# EAGLE design ESP12Breakout (EAGLE 7.7.0)
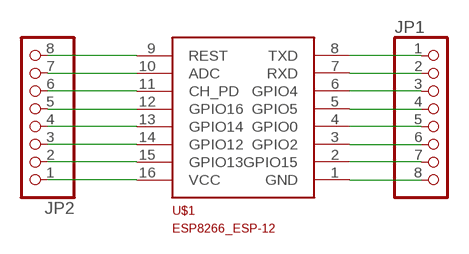
[diagram p0: schematic, sheet 1]

## Parts
JP1  PINHD-1X8  [1X08]
JP2  PINHD-1X8  [1X08]
U$1  ESP8266_ESP-12  [ESP8266-ESP12]

## Nets
N$1: JP1.1 U$1.8(TXD)
N$2: JP1.2 U$1.7(RXD)
N$3: JP1.3 U$1.6(GPIO4)
N$4: JP1.4 U$1.5(GPIO5)
N$5: JP1.5 U$1.4(GPIO0)
N$6: JP1.6 U$1.3(GPIO2)
N$7: JP1.7 U$1.2(GPIO15)
N$8: JP1.8 U$1.1(GND)
N$9: JP2.8 U$1.9(REST)
N$10: JP2.7 U$1.10(ADC)
N$11: JP2.6 U$1.11(CH_PD)
N$12: JP2.5 U$1.12(GPIO16)
N$13: JP2.4 U$1.13(GPIO14)
N$14: JP2.3 U$1.14(GPIO12)
N$15: JP2.2 U$1.15(GPIO13)
N$16: JP2.1 U$1.16(VCC)

## Library data of the parts
JP1 JP2 = pinhead:PINHD-1X8: PIN HEADER
U$1 = ESP8266-ESP12:ESP8266_ESP-12

## Board
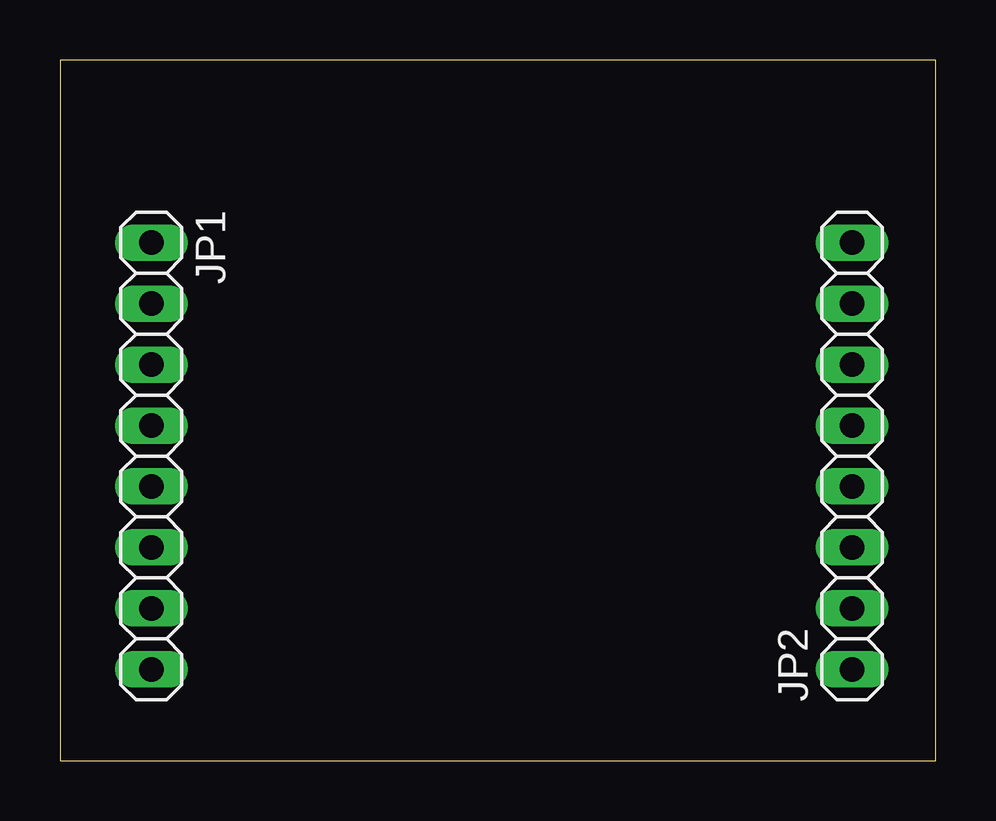
[diagram p1: board, top side]
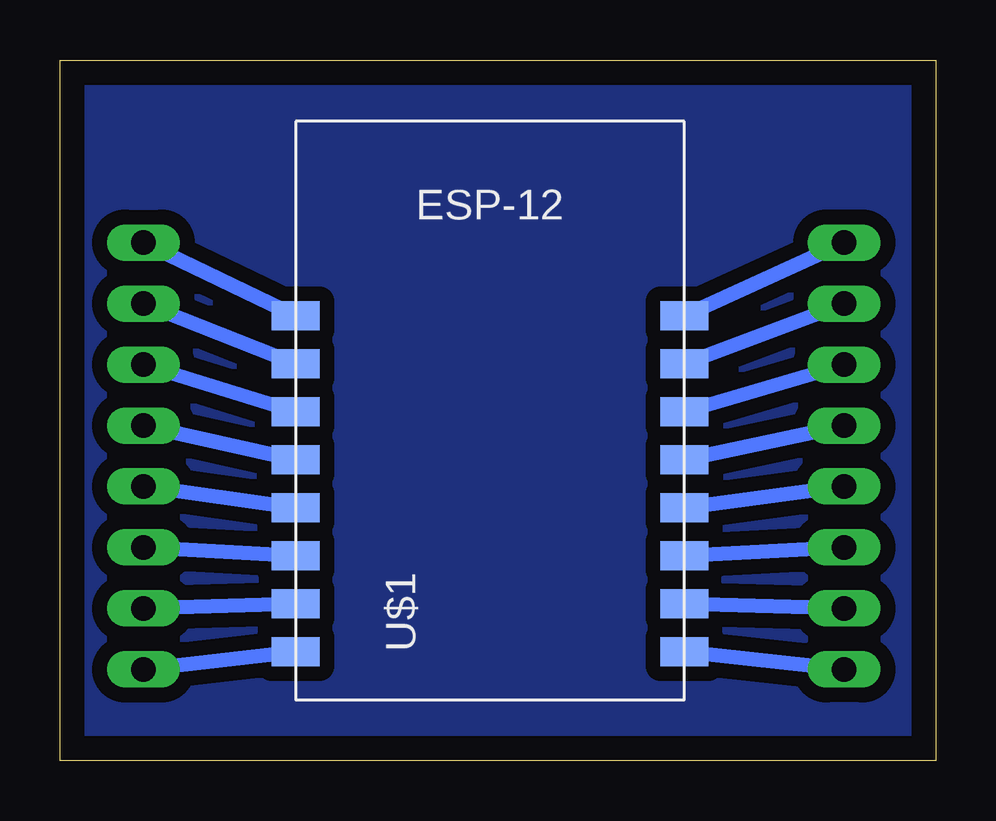
[diagram p2: board, bottom side, seen from below]

Size 36.5 x 29.2 mm. Coordinates in mm from the lower left corner, seen from the top.
Outline: 0,0 36.5,0 36.5,29.2 0,29.2 0,0
Copper layers (1*16): Top 0.035mm / dielectric 1.5mm / Bottom 0.035mm
Design rules "default": minimum track width 10mil, minimum drill 24mil, track to track 8mil, track to pad 8mil, pad to pad 8mil, via to via 8mil, smd to smd 8mil, copper to edge 40mil, drill to drill 8mil, minimum pad ring 10mil, minimum via ring 8mil, stop-mask expansion 4mil, vias tented up to drill 0mil, thermal gap 10mil

### Footprints (pad centres in the part's own frame; a part is rotated, then mirrored left to right if it is on the bottom)
1X08 = drill 1.016 long: 1 -8.89,0; 2 -6.35,0; 3 -3.81,0; 4 -1.27,0; 5 1.27,0; 6 3.81,0; 7 6.35,0; 8 8.89,0
ESP8266-ESP12 = smd 2 x 1.2: 1 16.2,2; 2 16.2,4; 3 16.2,6; 4 16.2,8; 5 16.2,10; 6 16.2,12; 7 16.2,14; 8 16.2,16; 9 0,16; 10 0,14; 11 0,12; 12 0,10; 13 0,8; 14 0,6; 15 0,4; 16 0,2

### Placement (x,y rotation side)
JP1  3.81,12.7 270 top
JP2  33.02,12.7 90 top
U$1  26.67,2.54 0 bottom

### Tracks (layer width: path | path; a pad name or v marks a point on that pad's centre or on a via)
GND
  pour Bottom (isolate 0.61): 0,29.21 36.83,29.21 36.83,0 0,0
N$1
  Bottom 0.61: U$1.8 JP1.1
N$2
  Bottom 0.61: U$1.7 JP1.2
N$3
  Bottom 0.61: U$1.6 JP1.3
N$4
  Bottom 0.61: U$1.5 JP1.4
N$5
  Bottom 0.61: U$1.4 JP1.5
N$6
  Bottom 0.61: U$1.3 JP1.6
N$7
  Bottom 0.61: U$1.2 JP1.7
N$8
  Bottom 0.61: U$1.1 JP1.8
N$9
  Bottom 0.61: U$1.9 JP2.8
N$10
  Bottom 0.61: U$1.10 JP2.7
N$11
  Bottom 0.61: U$1.11 JP2.6
N$12
  Bottom 0.61: U$1.12 JP2.5
N$13
  Bottom 0.61: U$1.13 JP2.4
N$14
  Bottom 0.61: U$1.14 JP2.3
N$15
  Bottom 0.61: U$1.15 JP2.2
N$16
  Bottom 0.61: U$1.16 JP2.1